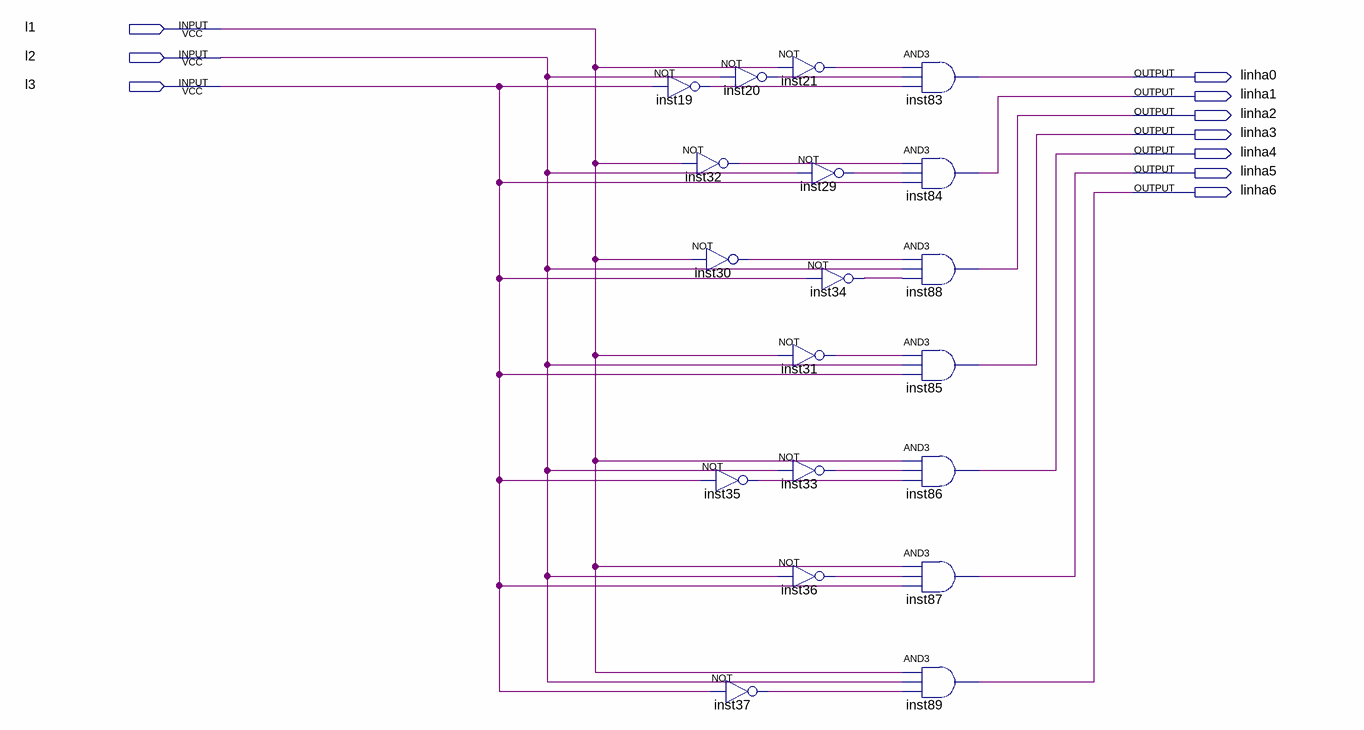
[diagram p0: schematic sheet]
// Quartus schematic decodificador6bits_linhas.bdf as structural Verilog: 19 symbols, 10 pins
module decodificador6bits_linhas (
  input  l1,
  input  l2,
  input  l3,
  output linha0,
  output linha1,
  output linha2,
  output linha3,
  output linha4,
  output linha5,
  output linha6
);

  wire inst19_out, inst20_out, inst21_out, inst29_out, inst30_out, inst31_out, inst32_out, inst33_out,
       inst34_out, inst35_out, inst36_out, inst37_out;

  not inst19 (inst19_out, l3);
  not inst32 (inst32_out, l1);
  not inst30 (inst30_out, l1);
  not inst20 (inst20_out, l2);
  not inst35 (inst35_out, l3);
  not inst37 (inst37_out, l3);
  not inst21 (inst21_out, l1);
  not inst29 (inst29_out, l2);
  not inst34 (inst34_out, l3);
  not inst31 (inst31_out, l1);
  not inst33 (inst33_out, l2);
  not inst36 (inst36_out, l2);
  and inst83 (linha0, inst21_out, inst20_out, inst19_out);
  and inst84 (linha1, inst32_out, inst29_out, l3);
  and inst88 (linha2, inst30_out, l2, inst34_out);
  and inst85 (linha3, inst31_out, l2, l3);
  and inst86 (linha4, l1, inst33_out, inst35_out);
  and inst87 (linha5, l1, inst36_out, l3);
  and inst89 (linha6, l1, l2, inst37_out);
endmodule
